# Altium schematic sheet Components.SchDoc
size A4
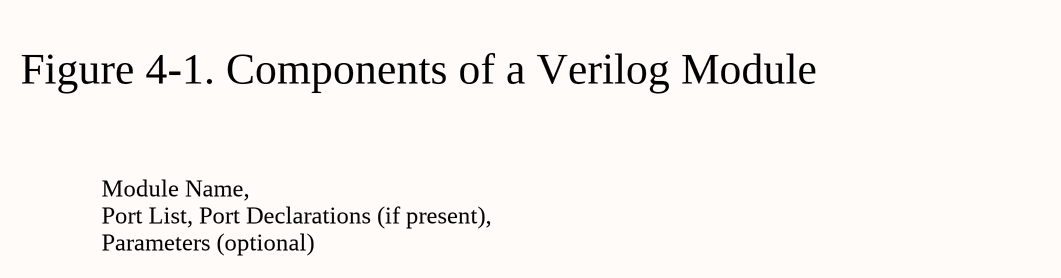
[diagram p0: Components.SchDoc]

## Notes on the sheet
- Figure 4-1. Components of a Verilog Module
- Module Name,
- Port List, Port Declarations (if present),
- Parameters (optional)